# Altium schematic sheet TWindow.SchDoc
size A4; Organization: Altium Limited; Address1: L3, 12a Rodborough Rd; Address2: Frenchs Forest; Address3: NSW; Address4: Australia 2086; DocumentNumber: 7; SheetNumber: 7; SheetTotal: 7
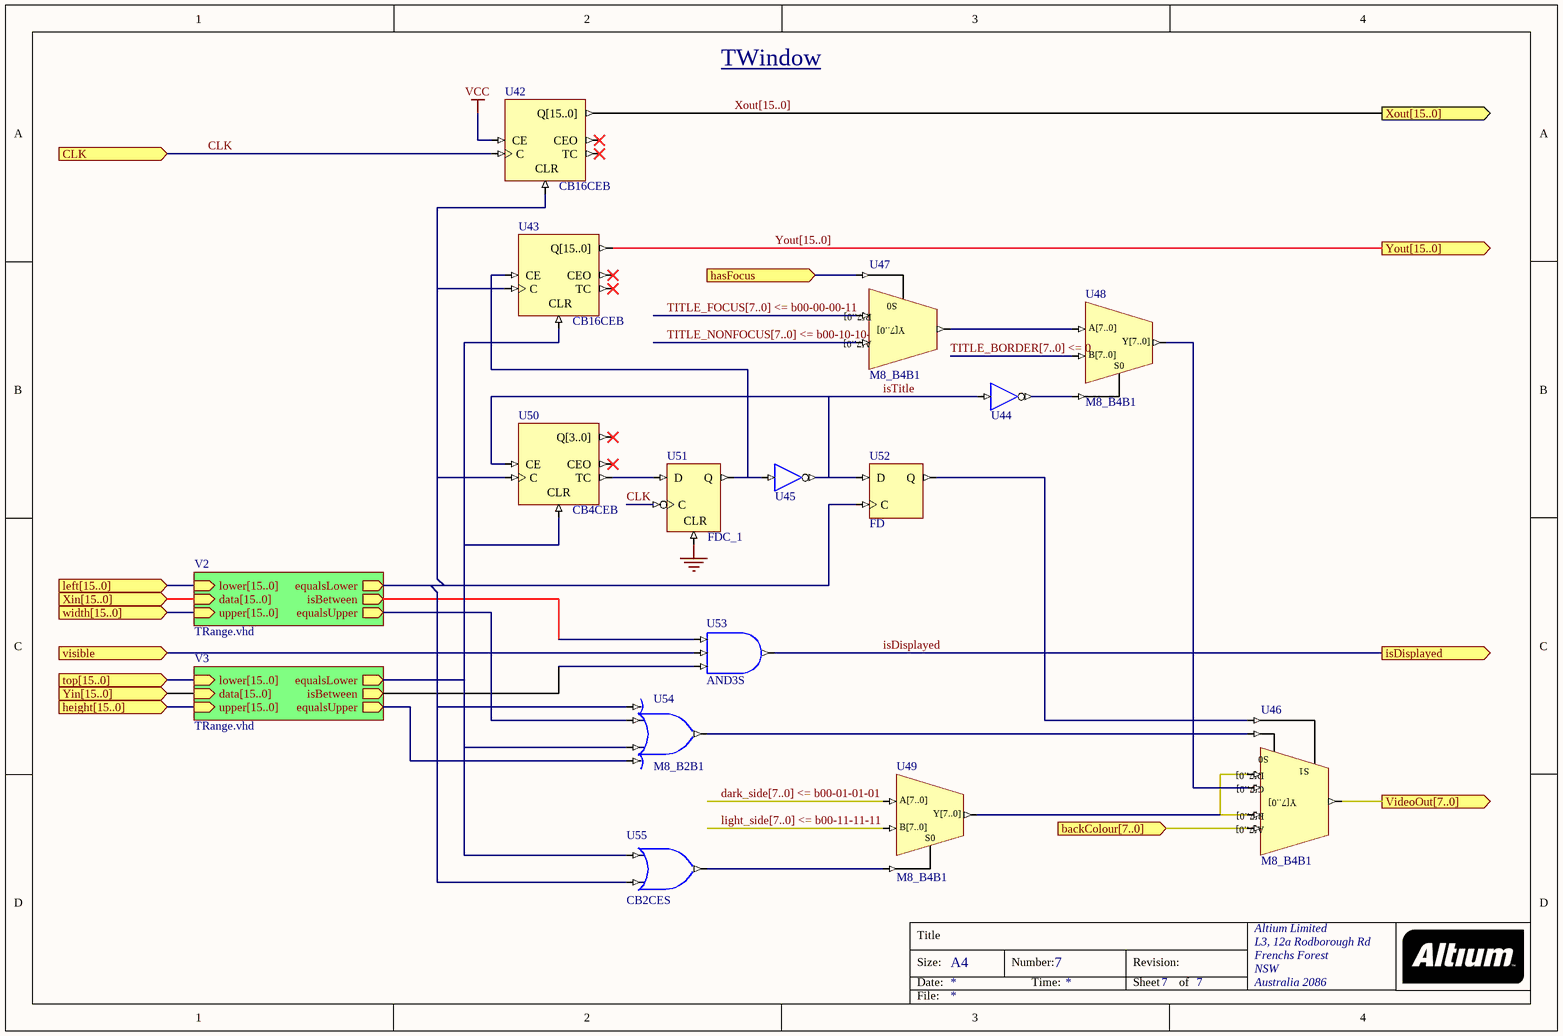
[diagram p0: TWindow.SchDoc]

## Parts
U42  CB16CEB
U43  CB16CEB
U44  INV  (value not drawn)
U45  INV  (value not drawn)
U46  M8_B4B1
U47  M8_B4B1
U48  M8_B4B1
U49  M8_B4B1
U50  CB4CEB
U51  FDC_1
U52  FD
U53  AND3S
U54  M8_B2B1
U55  CB2CES

## Sub-sheets
V2 = TRange.vhd: lower[15..0] (in), data[15..0] (in), upper[15..0] (in), isBetween (out), equalsLower (out), equalsUpper (out)
V3 = TRange.vhd: lower[15..0] (in), data[15..0] (in), upper[15..0] (in), isBetween (out), equalsLower (out), equalsUpper (out)

## Ports
backColour[7..0] (in), CLK (in), hasFocus (in), height[15..0] (in), isDisplayed (out), left[15..0] (in), top[15..0] (in), VideoOut[7..0] (out), visible (in), width[15..0] (in), Xin[15..0] (in), Xout[15..0] (out), Yin[15..0] (in), Yout[15..0] (out)

## Nets
GND: U51.CLR
VCC: U42.CE
backColour[7..0]: U46.A[7..0] ; port backColour[7..0]
CLK: U42.C U51.C ; port CLK
dark_side[7..0] <= b00-01-01-01: U49.A[7..0]
hasFocus: U47.S0 ; port hasFocus
isDisplayed: U53.O ; port isDisplayed
isTitle: U44.I U45.O U50.CE U52.D
light_side[7..0] <= b00-11-11-11: U49.B[7..0]
TITLE_BORDER[7..0] <= 0: U48.B[7..0]
TITLE_FOCUS[7..0] <= b00-00-00-11: U47.B[7..0]
TITLE_NONFOCUS[7..0] <= b00-10-10-10: U47.A[7..0]
VideoOut[7..0]: U46.Y[7..0] ; port VideoOut[7..0]
visible: U53.I1 ; port visible
Xout[15..0]: U42.Q[15..0] ; port Xout[15..0]
Yout[15..0]: U43.Q[15..0] ; port Yout[15..0]
NetU42_CLR: U42.CLR U43.C U50.C U52.C U54.I0 U55.I1 ; sheet V2/equalsLower
NetU43_CE: U43.CE U45.I U51.Q
NetU43_CLR: U43.CLR U50.CLR U54.I2 U55.I0 ; sheet V3/equalsLower
NetU44_O: U44.O U48.S0
NetU46_B[7..0]: U46.B[7..0] U46.D[7..0] U49.Y[7..0]
NetU46_C[7..0]: U46.C[7..0] U48.Y[7..0]
NetU46_S0: U46.S0 U54.O
NetU46_S1: U46.S1 U52.Q
NetU47_Y[7..0]: U47.Y[7..0] U48.A[7..0]
NetU49_S0: U49.S0 U55.O
NetU50_TC: U50.TC U51.D
NetU53_I0: U53.I0 ; sheet V2/isBetween
NetU53_I2: U53.I2 ; sheet V3/isBetween
NetU54_I1: U54.I1 ; sheet V2/equalsUpper
NetU54_I3: U54.I3 ; sheet V3/equalsUpper

Not connected (* = marked no-connect by the designer): U42 CEO* TC*; U43 CEO* TC*; U50 CEO* Q[3..0]*

## Buses and harness runs
bus dark_side[7..0] <= b00-01-01-01
bus light_side[7..0] <= b00-11-11-11
bus port height[15..0] = sheet V3/upper[15..0]
bus port left[15..0] = sheet V2/lower[15..0]
bus port top[15..0] = sheet V3/lower[15..0]
bus port width[15..0] = sheet V2/upper[15..0]
bus port Xin[15..0] = sheet V2/data[15..0]
bus port Yin[15..0] = sheet V3/data[15..0]
bus TITLE_BORDER[7..0] <= 0
bus TITLE_FOCUS[7..0] <= b00-00-00-11
bus TITLE_NONFOCUS[7..0] <= b00-10-10-10
bus Xout[15..0] = port Xout[15..0]
bus Yout[15..0] = port Yout[15..0]

## Notes on the sheet
- TWindow
- Title
- Size:
- Date:
- A4
- Number:
- Time:
- Revision:
- Sheet
- of
- File:

## Library data of the parts
U42 U43 = CB16CEB: 16-Bit Cascadable Binary Counters with Clock Enable and Asynchronous Clear, Bus Version; Xilinx Equivalent: CB16CE; ArchiveName: GENERIC; VHDLIB_SIM: GENERIC_LIB; Published: 29-Jan-2004; Publisher: Altium Limited; Core Revision: 1.00.00
U44 U45 = INV: Inverter; ArchiveName: GENERIC; VHDLIB_SIM: GENERIC_LIB; Published: 29-Jan-2004; Publisher: Altium Limited; Xilinx Equivalent: INV; Core Revision: 1.00.00
U46 = M8_B4B1: 4x8-Bit Bus to 1x8-Bit Bus Multiplexer; ArchiveName: GENERIC; VHDLIB_SIM: GENERIC_LIB; Published: 29-Jan-2004; Publisher: Altium Limited; Core Revision: 1.00.00
U47-U49 = M8_B2B1: 2x8-Bit Bus to 1x8-Bit Bus Multiplexer; ArchiveName: GENERIC; VHDLIB_SIM: GENERIC_LIB; Published: 29-Jan-2004; Publisher: Altium Limited; Core Revision: 1.00.00
U50 = CB4CEB: 4-Bit Cascadable Binary Counters with Clock Enable and Asynchronous Clear, Bus Version; ArchiveName: GENERIC; VHDLIB_SIM: GENERIC_LIB; Published: 29-Jan-2004; Publisher: Altium Limited; Core Revision: 1.00.00
U51 = FDC_1: D-Type Negative Edge Flip-Flop with Asynchronous Clear; ArchiveName: GENERIC; VHDLIB_SIM: GENERIC_LIB; Published: 29-Jan-2004; Publisher: Altium Limited; Xilinx Equivalent: FDC_1; Core Revision: 1.00.00
U52 = FD: D-Type Flip-Flop; ArchiveName: GENERIC; VHDLIB_SIM: GENERIC_LIB; Published: 29-Jan-2004; Publisher: Altium Limited; Xilinx Equivalent: FD; Core Revision: 1.00.00
U53 = AND3S: 3-Input AND Gate, Single Pin Version; Xilinx Equivalent: AND3; ArchiveName: GENERIC; VHDLIB_SIM: GENERIC_LIB; Published: 29-Jan-2004; Publisher: Altium Limited; Core Revision: 1.00.00
U54 = OR4S: 4-Input OR Gate, Single Pin Version; Xilinx Equivalent: OR4; ArchiveName: GENERIC; VHDLIB_SIM: GENERIC_LIB; Published: 29-Jan-2004; Publisher: Altium Limited; Core Revision: 1.00.00
U55 = OR2S: 2-Input OR Gate, Single Pin Version; Xilinx Equivalent: OR2; ArchiveName: GENERIC; VHDLIB_SIM: GENERIC_LIB; Published: 29-Jan-2004; Publisher: Altium Limited; Core Revision: 1.00.00